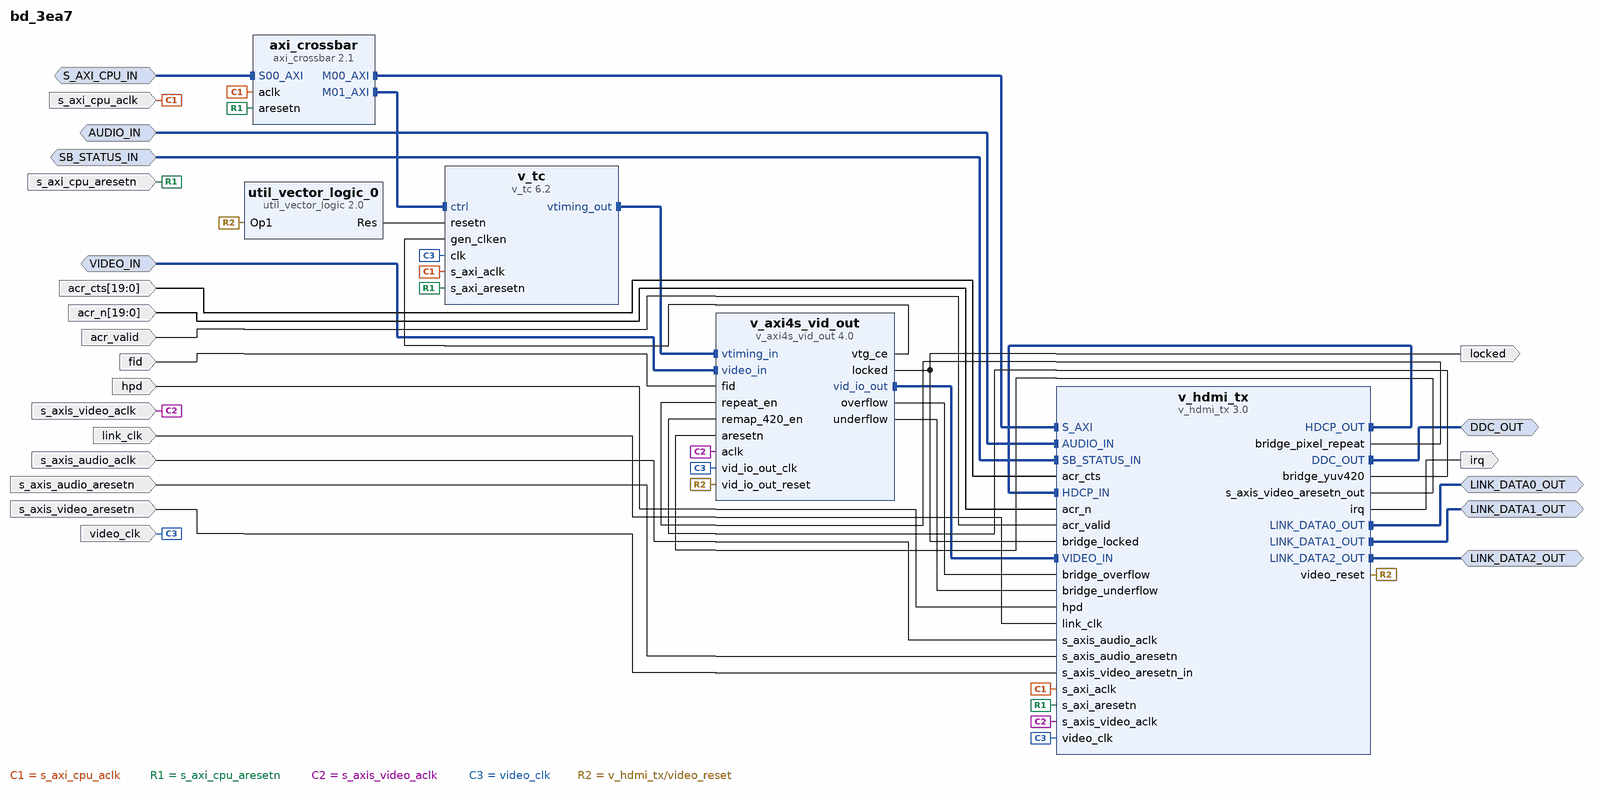
[diagram p0: block diagram of the top level]
# Vivado block design bd_3ea7, xc7k325tffg900-2, Vivado 2021.2
create_bd_design bd_3ea7

create_bd_intf_port -mode Master -vlnv xilinx.com:interface:axis_rtl:1.0 LINK_DATA0_OUT
create_bd_intf_port -mode Master -vlnv xilinx.com:interface:axis_rtl:1.0 LINK_DATA1_OUT
create_bd_intf_port -mode Master -vlnv xilinx.com:interface:axis_rtl:1.0 LINK_DATA2_OUT
create_bd_intf_port -mode Master -vlnv xilinx.com:interface:iic_rtl:1.0 DDC_OUT
create_bd_intf_port -mode Slave -vlnv xilinx.com:interface:aximm_rtl:1.0 S_AXI_CPU_IN
set_property -dict {CONFIG.ADDR_WIDTH 17 CONFIG.DATA_WIDTH 32 CONFIG.PROTOCOL AXI4LITE} [get_bd_intf_ports S_AXI_CPU_IN]
create_bd_intf_port -mode Slave -vlnv xilinx.com:interface:axis_rtl:1.0 AUDIO_IN
create_bd_intf_port -mode Slave -vlnv xilinx.com:interface:axis_rtl:1.0 SB_STATUS_IN
create_bd_intf_port -mode Slave -vlnv xilinx.com:interface:axis_rtl:1.0 VIDEO_IN
create_bd_port -dir I -type clk s_axi_cpu_aclk
set_property -dict [list \
  CONFIG.ASSOCIATED_BUSIF SB_STATUS_IN:S_AXI_CPU_IN \
  CONFIG.ASSOCIATED_RESET s_axi_cpu_aresetn \
] [get_bd_ports s_axi_cpu_aclk]
create_bd_port -dir I -type rst s_axi_cpu_aresetn
create_bd_port -dir I -type clk link_clk
create_bd_port -dir I -type clk s_axis_audio_aclk
set_property -dict [list \
  CONFIG.ASSOCIATED_BUSIF AUDIO_IN \
  CONFIG.ASSOCIATED_RESET s_axis_audio_aresetn \
] [get_bd_ports s_axis_audio_aclk]
create_bd_port -dir I -type rst s_axis_audio_aresetn
create_bd_port -dir I -from 19 -to 0 acr_cts
create_bd_port -dir I -from 19 -to 0 acr_n
create_bd_port -dir I acr_valid
create_bd_port -dir I hpd
create_bd_port -dir O -type intr irq
create_bd_port -dir I -type clk video_clk
create_bd_port -dir I fid
create_bd_port -dir O locked
create_bd_port -dir I -type clk s_axis_video_aclk
set_property -dict [list \
  CONFIG.ASSOCIATED_BUSIF VIDEO_IN \
  CONFIG.ASSOCIATED_RESET s_axis_video_aresetn \
] [get_bd_ports s_axis_video_aclk]
create_bd_port -dir I -type rst s_axis_video_aresetn

create_bd_cell -type ip -vlnv xilinx.com:ip:v_hdmi_tx:3.0 v_hdmi_tx
set_property -dict [list \
  CONFIG.C_BITS_PER_COMPONENT 8 \
  CONFIG.C_CH_WIDTH 8 \
  CONFIG.C_HDCP_IF_ENABLE 0 \
  CONFIG.C_PIXELS_PER_CLOCK 2 \
  CONFIG.C_SIM_DEVICE VERSAL_AI_CORE_ES1 \
  CONFIG.C_SIM_DEVICE_EN 0 \
  CONFIG.C_TST_DBG 0 \
  CONFIG.C_VECTOR_DE_ENABLE 0 \
  CONFIG.C_VIDEO_MASK_ENABLE 1 \
] [get_bd_cells v_hdmi_tx]
create_bd_cell -type ip -vlnv xilinx.com:ip:v_tc:6.2 v_tc
set_property -dict [list \
  CONFIG.GEN_FIELDID_EN true \
  CONFIG.INTERLACE_EN true \
  CONFIG.enable_detection false \
  CONFIG.max_clocks_per_line 8192 \
] [get_bd_cells v_tc]
create_bd_cell -type ip -vlnv xilinx.com:ip:v_axi4s_vid_out:4.0 v_axi4s_vid_out
set_property -dict [list \
  CONFIG.C_ADDR_WIDTH 10 \
  CONFIG.C_ADDR_WIDTH_PIXEL_REMAP_420 11 \
  CONFIG.C_HAS_ASYNC_CLK 1 \
  CONFIG.C_HYSTERESIS_LEVEL 12 \
  CONFIG.C_INCLUDE_PIXEL_REMAP_420 1 \
  CONFIG.C_INCLUDE_PIXEL_REPEAT 1 \
  CONFIG.C_NATIVE_COMPONENT_WIDTH 8 \
  CONFIG.C_PIXELS_PER_CLOCK 2 \
  CONFIG.C_S_AXIS_VIDEO_DATA_WIDTH 8 \
] [get_bd_cells v_axi4s_vid_out]
create_bd_cell -type ip -vlnv xilinx.com:ip:util_vector_logic:2.0 util_vector_logic_0
set_property -dict {CONFIG.C_OPERATION not CONFIG.C_SIZE 1} [get_bd_cells util_vector_logic_0]
create_bd_cell -type ip -vlnv xilinx.com:ip:axi_crossbar:2.1 axi_crossbar
set_property -dict [list \
  CONFIG.ADDR_WIDTH 17 \
  CONFIG.DATA_WIDTH 32 \
  CONFIG.NUM_MI 2 \
  CONFIG.PROTOCOL AXI4LITE \
] [get_bd_cells axi_crossbar]

# ---- connections ----

connect_bd_intf_net -intf_net intf_net_axi_crossbar_M00_AXI [get_bd_intf_pins axi_crossbar/M00_AXI] [get_bd_intf_pins v_hdmi_tx/S_AXI]
connect_bd_intf_net -intf_net intf_net_axi_crossbar_M01_AXI [get_bd_intf_pins axi_crossbar/M01_AXI] [get_bd_intf_pins v_tc/ctrl]
connect_bd_intf_net -intf_net intf_net_bdry_in_AUDIO_IN [get_bd_intf_ports AUDIO_IN] [get_bd_intf_pins v_hdmi_tx/AUDIO_IN]
connect_bd_intf_net -intf_net intf_net_bdry_in_SB_STATUS_IN [get_bd_intf_ports SB_STATUS_IN] [get_bd_intf_pins v_hdmi_tx/SB_STATUS_IN]
connect_bd_intf_net -intf_net intf_net_bdry_in_S_AXI_CPU_IN [get_bd_intf_ports S_AXI_CPU_IN] [get_bd_intf_pins axi_crossbar/S00_AXI]
connect_bd_intf_net -intf_net intf_net_bdry_in_VIDEO_IN [get_bd_intf_ports VIDEO_IN] [get_bd_intf_pins v_axi4s_vid_out/video_in]
connect_bd_intf_net -intf_net intf_net_v_axi4s_vid_out_vid_io_out [get_bd_intf_pins v_axi4s_vid_out/vid_io_out] [get_bd_intf_pins v_hdmi_tx/VIDEO_IN]
connect_bd_intf_net -intf_net intf_net_v_hdmi_tx_DDC_OUT [get_bd_intf_ports DDC_OUT] [get_bd_intf_pins v_hdmi_tx/DDC_OUT]
connect_bd_intf_net -intf_net intf_net_v_hdmi_tx_LINK_DATA0_OUT [get_bd_intf_ports LINK_DATA0_OUT] [get_bd_intf_pins v_hdmi_tx/LINK_DATA0_OUT]
connect_bd_intf_net -intf_net intf_net_v_hdmi_tx_LINK_DATA1_OUT [get_bd_intf_ports LINK_DATA1_OUT] [get_bd_intf_pins v_hdmi_tx/LINK_DATA1_OUT]
connect_bd_intf_net -intf_net intf_net_v_hdmi_tx_LINK_DATA2_OUT [get_bd_intf_ports LINK_DATA2_OUT] [get_bd_intf_pins v_hdmi_tx/LINK_DATA2_OUT]
connect_bd_intf_net -intf_net intf_net_v_hdmi_tx_hdcp_out [get_bd_intf_pins v_hdmi_tx/HDCP_OUT] [get_bd_intf_pins v_hdmi_tx/HDCP_IN]
connect_bd_intf_net -intf_net intf_net_v_tc_vtiming_out [get_bd_intf_pins v_tc/vtiming_out] [get_bd_intf_pins v_axi4s_vid_out/vtiming_in]
connect_bd_net -net net_bdry_in_acr_cts [get_bd_ports acr_cts] [get_bd_pins v_hdmi_tx/acr_cts]
connect_bd_net -net net_bdry_in_acr_n [get_bd_ports acr_n] [get_bd_pins v_hdmi_tx/acr_n]
connect_bd_net -net net_bdry_in_acr_valid [get_bd_ports acr_valid] [get_bd_pins v_hdmi_tx/acr_valid]
connect_bd_net -net net_bdry_in_fid [get_bd_ports fid] [get_bd_pins v_axi4s_vid_out/fid]
connect_bd_net -net net_bdry_in_hpd [get_bd_ports hpd] [get_bd_pins v_hdmi_tx/hpd]
connect_bd_net -net net_bdry_in_link_clk [get_bd_ports link_clk] [get_bd_pins v_hdmi_tx/link_clk]
connect_bd_net -net net_bdry_in_s_axi_cpu_aclk [get_bd_ports s_axi_cpu_aclk] \
  [get_bd_pins v_hdmi_tx/s_axi_aclk] [get_bd_pins v_tc/s_axi_aclk] [get_bd_pins axi_crossbar/aclk]
connect_bd_net -net net_bdry_in_s_axi_cpu_aresetn [get_bd_ports s_axi_cpu_aresetn] \
  [get_bd_pins v_hdmi_tx/s_axi_aresetn] [get_bd_pins v_tc/s_axi_aresetn] [get_bd_pins axi_crossbar/aresetn]
connect_bd_net -net net_bdry_in_s_axis_audio_aclk [get_bd_ports s_axis_audio_aclk] [get_bd_pins v_hdmi_tx/s_axis_audio_aclk]
connect_bd_net -net net_bdry_in_s_axis_audio_aresetn [get_bd_ports s_axis_audio_aresetn] [get_bd_pins v_hdmi_tx/s_axis_audio_aresetn]
connect_bd_net -net net_bdry_in_s_axis_video_aclk [get_bd_ports s_axis_video_aclk] \
  [get_bd_pins v_axi4s_vid_out/aclk] [get_bd_pins v_hdmi_tx/s_axis_video_aclk]
connect_bd_net -net net_bdry_in_s_axis_video_aresetn [get_bd_ports s_axis_video_aresetn] [get_bd_pins v_hdmi_tx/s_axis_video_aresetn_in]
connect_bd_net -net net_bdry_in_video_clk [get_bd_ports video_clk] \
  [get_bd_pins v_hdmi_tx/video_clk] [get_bd_pins v_tc/clk] [get_bd_pins v_axi4s_vid_out/vid_io_out_clk]
connect_bd_net -net net_util_vector_logic_0_Res [get_bd_pins util_vector_logic_0/Res] [get_bd_pins v_tc/resetn]
connect_bd_net -net net_v_axi4s_vid_out_locked [get_bd_pins v_axi4s_vid_out/locked] [get_bd_ports locked] [get_bd_pins v_hdmi_tx/bridge_locked]
connect_bd_net -net net_v_axi4s_vid_out_overflow [get_bd_pins v_axi4s_vid_out/overflow] [get_bd_pins v_hdmi_tx/bridge_overflow]
connect_bd_net -net net_v_axi4s_vid_out_underflow [get_bd_pins v_axi4s_vid_out/underflow] [get_bd_pins v_hdmi_tx/bridge_underflow]
connect_bd_net -net net_v_axi4s_vid_out_vtg_ce [get_bd_pins v_axi4s_vid_out/vtg_ce] [get_bd_pins v_tc/gen_clken]
connect_bd_net -net net_v_hdmi_tx_bridge_pixel_repeat [get_bd_pins v_hdmi_tx/bridge_pixel_repeat] [get_bd_pins v_axi4s_vid_out/repeat_en]
connect_bd_net -net net_v_hdmi_tx_bridge_yuv420 [get_bd_pins v_hdmi_tx/bridge_yuv420] [get_bd_pins v_axi4s_vid_out/remap_420_en]
connect_bd_net -net net_v_hdmi_tx_irq [get_bd_pins v_hdmi_tx/irq] [get_bd_ports irq]
connect_bd_net -net net_v_hdmi_tx_s_axis_video_aresetn_out [get_bd_pins v_hdmi_tx/s_axis_video_aresetn_out] [get_bd_pins v_axi4s_vid_out/aresetn]
connect_bd_net -net net_v_hdmi_tx_video_reset [get_bd_pins v_hdmi_tx/video_reset] \
  [get_bd_pins v_axi4s_vid_out/vid_io_out_reset] [get_bd_pins util_vector_logic_0/Op1]

# ---- address map ----
assign_bd_address -offset 0x00000 -range 64K -target_address_space [get_bd_addr_spaces S_AXI_CPU_IN] [get_bd_addr_segs v_hdmi_tx/S_AXI/reg0]
assign_bd_address -offset 0x10000 -range 64K -target_address_space [get_bd_addr_spaces S_AXI_CPU_IN] [get_bd_addr_segs v_tc/ctrl/Reg]

validate_bd_design
save_bd_design
